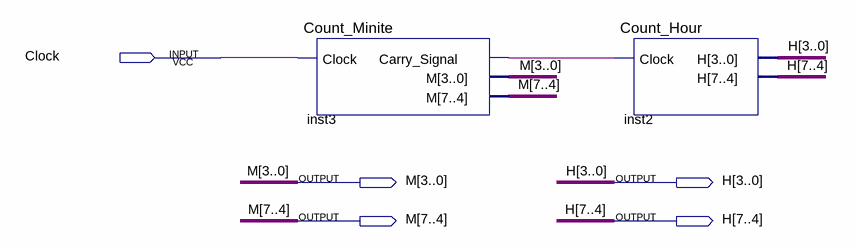
[diagram p0: schematic sheet]
// Quartus schematic TimeingModule_Minute_Hour.bdf as structural Verilog: 2 symbols, 5 pins
module TimeingModule_Minute_Hour (
  input  Clock,
  output [7:0] M,
  output [7:0] H
);

  wire inst3_carry_signal;

  Count_Minite inst3 (.Clock(Clock), .Carry_Signal(inst3_carry_signal), .M(M));
  Count_Hour inst2 (.Clock(inst3_carry_signal), .H(H));
endmodule
